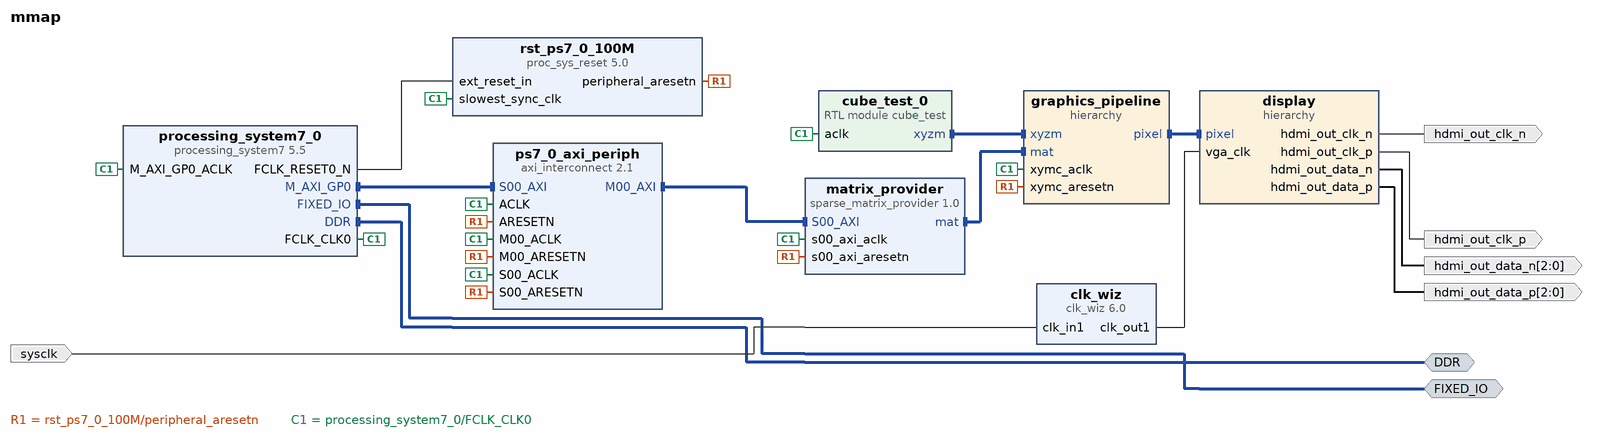
[diagram p0: block diagram of the top level]
# Vivado block design mmap, xc7z020clg400-1, Vivado 2018.3
create_bd_design mmap

create_bd_intf_port -mode Master -vlnv xilinx.com:interface:ddrx_rtl:1.0 DDR
create_bd_intf_port -mode Master -vlnv xilinx.com:display_processing_system7:fixedio_rtl:1.0 FIXED_IO
create_bd_port -dir I -type clk sysclk
set_property -dict {CONFIG.FREQ_HZ 125000000} [get_bd_ports sysclk]
create_bd_port -dir O hdmi_out_clk_n
create_bd_port -dir O hdmi_out_clk_p
create_bd_port -dir O -from 2 -to 0 hdmi_out_data_p
create_bd_port -dir O -from 2 -to 0 hdmi_out_data_n

create_bd_cell -type ip -vlnv xilinx.com:ip:processing_system7:5.5 processing_system7_0
set_property -dict [list \
  CONFIG.PCW_APU_PERIPHERAL_FREQMHZ 650 \
  CONFIG.PCW_CRYSTAL_PERIPHERAL_FREQMHZ 50 \
  CONFIG.PCW_ENET0_ENET0_IO {MIO 16 .. 27} \
  CONFIG.PCW_ENET0_GRP_MDIO_ENABLE 1 \
  CONFIG.PCW_ENET0_GRP_MDIO_IO {MIO 52 .. 53} \
  CONFIG.PCW_ENET0_PERIPHERAL_ENABLE 1 \
  CONFIG.PCW_ENET0_RESET_ENABLE 1 \
  CONFIG.PCW_ENET0_RESET_IO {MIO 9} \
  CONFIG.PCW_ENET_RESET_ENABLE 1 \
  CONFIG.PCW_ENET_RESET_SELECT {Share reset pin} \
  CONFIG.PCW_FPGA0_PERIPHERAL_FREQMHZ 100 \
  CONFIG.PCW_FPGA1_PERIPHERAL_FREQMHZ 50 \
  CONFIG.PCW_GPIO_MIO_GPIO_ENABLE 1 \
  CONFIG.PCW_GPIO_MIO_GPIO_IO MIO \
  CONFIG.PCW_I2C_RESET_ENABLE 1 \
  CONFIG.PCW_M_AXI_GP0_FREQMHZ 10 \
  CONFIG.PCW_PERIPHERAL_BOARD_PRESET part0 \
  CONFIG.PCW_PRESET_BANK1_VOLTAGE {LVCMOS 1.8V} \
  CONFIG.PCW_QSPI_GRP_FBCLK_ENABLE 1 \
  CONFIG.PCW_QSPI_GRP_FBCLK_IO {MIO 8} \
  CONFIG.PCW_QSPI_GRP_SINGLE_SS_ENABLE 1 \
  CONFIG.PCW_QSPI_GRP_SINGLE_SS_IO {MIO 1 .. 6} \
  CONFIG.PCW_QSPI_PERIPHERAL_ENABLE 1 \
  CONFIG.PCW_QSPI_QSPI_IO {MIO 1 .. 6} \
  CONFIG.PCW_SD0_GRP_CD_ENABLE 1 \
  CONFIG.PCW_SD0_GRP_CD_IO {MIO 47} \
  CONFIG.PCW_SD0_GRP_WP_ENABLE 0 \
  CONFIG.PCW_SD0_PERIPHERAL_ENABLE 1 \
  CONFIG.PCW_SD0_SD0_IO {MIO 40 .. 45} \
  CONFIG.PCW_SDIO_PERIPHERAL_FREQMHZ 50 \
  CONFIG.PCW_SINGLE_QSPI_DATA_MODE x4 \
  CONFIG.PCW_UART0_PERIPHERAL_ENABLE 1 \
  CONFIG.PCW_UART0_UART0_IO {MIO 14 .. 15} \
  CONFIG.PCW_UART1_PERIPHERAL_ENABLE 0 \
  CONFIG.PCW_UART_PERIPHERAL_FREQMHZ 100 \
  CONFIG.PCW_UIPARAM_DDR_BUS_WIDTH {16 Bit} \
  CONFIG.PCW_UIPARAM_DDR_FREQ_MHZ 525 \
  CONFIG.PCW_UIPARAM_DDR_PARTNO {MT41J256M16 RE-125} \
  CONFIG.PCW_USB0_PERIPHERAL_ENABLE 0 \
  CONFIG.PCW_USB_RESET_ENABLE 1 \
] [get_bd_cells processing_system7_0]
# 484 more settings of processing_system7_0 are not shown: defaults, MIO pin electricals, DDR timing, and values the tool derives
create_bd_cell -type ip -vlnv xilinx.com:ip:clk_wiz:6.0 clk_wiz
set_property -dict [list \
  CONFIG.CLKIN1_JITTER_PS 80.0 \
  CONFIG.CLKOUT1_DRIVES BUFG \
  CONFIG.CLKOUT1_JITTER 209.236 \
  CONFIG.CLKOUT1_PHASE_ERROR 234.038 \
  CONFIG.CLKOUT1_REQUESTED_OUT_FREQ 108 \
  CONFIG.CLKOUT2_DRIVES BUFG \
  CONFIG.CLKOUT3_DRIVES BUFG \
  CONFIG.CLKOUT4_DRIVES BUFG \
  CONFIG.CLKOUT5_DRIVES BUFG \
  CONFIG.CLKOUT6_DRIVES BUFG \
  CONFIG.CLKOUT7_DRIVES BUFG \
  CONFIG.FEEDBACK_SOURCE FDBK_AUTO \
  CONFIG.MMCM_CLKFBOUT_MULT_F 40.500 \
  CONFIG.MMCM_CLKIN1_PERIOD 8.000 \
  CONFIG.MMCM_CLKOUT0_DIVIDE_F 9.375 \
  CONFIG.MMCM_COMPENSATION ZHOLD \
  CONFIG.MMCM_DIVCLK_DIVIDE 5 \
  CONFIG.PRIMITIVE MMCM \
  CONFIG.PRIM_IN_FREQ 125 \
  CONFIG.USE_LOCKED false \
  CONFIG.USE_RESET false \
] [get_bd_cells clk_wiz]
create_bd_cell -type hier display
create_bd_cell -type ip -vlnv xilinx.com:ip:proc_sys_reset:5.0 rst_ps7_0_100M
create_bd_cell -type hier graphics_pipeline
create_bd_cell -type ip -vlnv xilinx.com:ip:axi_interconnect:2.1 ps7_0_axi_periph
set_property -dict {CONFIG.NUM_MI 1} [get_bd_cells ps7_0_axi_periph]
create_bd_cell -type ip -vlnv user.org:user:sparse_matrix_provider:1.0 matrix_provider
create_bd_cell -type module -reference cube_test cube_test_0

# ---- hierarchy /display ----
current_bd_instance /display
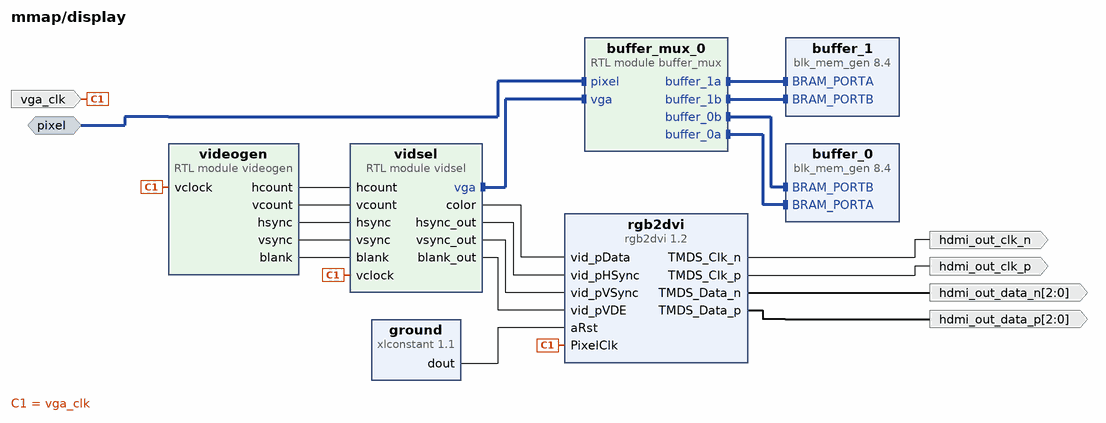
[diagram p1: block diagram inside /display]
create_bd_intf_pin -mode Slave -vlnv huntingt:user:pixel_rtl:1.0 pixel
create_bd_pin -dir I -type clk vga_clk
create_bd_pin -dir O -type clk hdmi_out_clk_p
create_bd_pin -dir O -type clk hdmi_out_clk_n
create_bd_pin -dir O -from 2 -to 0 hdmi_out_data_p
create_bd_pin -dir O -from 2 -to 0 hdmi_out_data_n

create_bd_cell -type ip -vlnv xilinx.com:ip:blk_mem_gen:8.4 buffer_0
set_property -dict [list \
  CONFIG.Enable_32bit_Address false \
  CONFIG.Enable_B Use_ENB_Pin \
  CONFIG.Fill_Remaining_Memory_Locations false \
  CONFIG.Load_Init_File false \
  CONFIG.Memory_Type Simple_Dual_Port_RAM \
  CONFIG.Operating_Mode_A NO_CHANGE \
  CONFIG.Port_B_Clock 100 \
  CONFIG.Port_B_Enable_Rate 100 \
  CONFIG.Read_Width_B 1 \
  CONFIG.Register_PortB_Output_of_Memory_Primitives true \
  CONFIG.Use_Byte_Write_Enable false \
  CONFIG.Write_Depth_A 1048576 \
  CONFIG.Write_Width_A 1 \
  CONFIG.Write_Width_B 1 \
  CONFIG.use_bram_block Stand_Alone \
] [get_bd_cells buffer_0]
create_bd_cell -type ip -vlnv digilentinc.com:ip:rgb2dvi:1.2 rgb2dvi
set_property -dict {CONFIG.kClkRange 2} [get_bd_cells rgb2dvi]
create_bd_cell -type ip -vlnv xilinx.com:ip:blk_mem_gen:8.4 buffer_1
set_property -dict [list \
  CONFIG.Enable_32bit_Address false \
  CONFIG.Enable_B Use_ENB_Pin \
  CONFIG.Memory_Type Simple_Dual_Port_RAM \
  CONFIG.Operating_Mode_A NO_CHANGE \
  CONFIG.Port_B_Clock 100 \
  CONFIG.Port_B_Enable_Rate 100 \
  CONFIG.Read_Width_B 1 \
  CONFIG.Register_PortB_Output_of_Memory_Primitives true \
  CONFIG.Use_Byte_Write_Enable false \
  CONFIG.Write_Depth_A 1048576 \
  CONFIG.Write_Width_A 1 \
  CONFIG.Write_Width_B 1 \
  CONFIG.use_bram_block Stand_Alone \
] [get_bd_cells buffer_1]
create_bd_cell -type ip -vlnv xilinx.com:ip:xlconstant:1.1 ground
set_property -dict {CONFIG.CONST_VAL 0} [get_bd_cells ground]
create_bd_cell -type module -reference buffer_mux buffer_mux_0
create_bd_cell -type module -reference videogen videogen
create_bd_cell -type module -reference vidsel vidsel

# ---- hierarchy /graphics_pipeline ----
current_bd_instance /graphics_pipeline
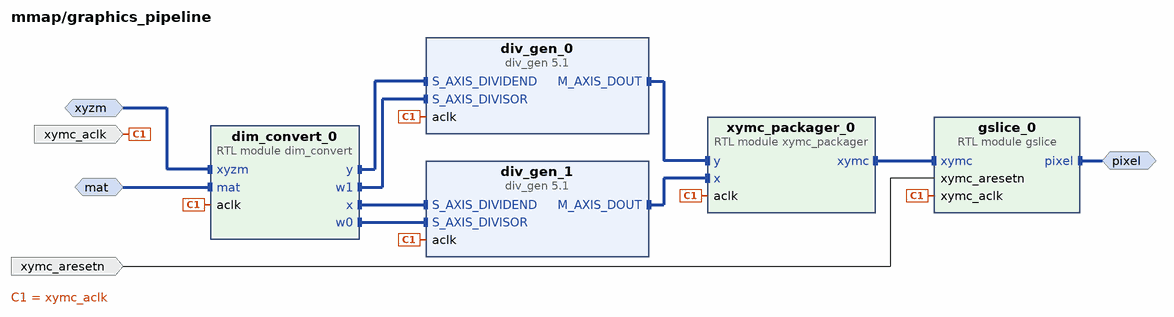
[diagram p2: block diagram inside /graphics_pipeline]
create_bd_intf_pin -mode Slave -vlnv xilinx.com:interface:axis_rtl:1.0 xyzm
create_bd_intf_pin -mode Slave -vlnv xilinx.com:interface:axis_rtl:1.0 mat
create_bd_intf_pin -mode Master -vlnv huntingt:user:pixel_rtl:1.0 pixel
create_bd_pin -dir I -type rst xymc_aresetn
create_bd_pin -dir I -type clk xymc_aclk

create_bd_cell -type ip -vlnv xilinx.com:ip:div_gen:5.1 div_gen_0
set_property -dict [list \
  CONFIG.FlowControl Blocking \
  CONFIG.OptimizeGoal Resources \
  CONFIG.OutTLASTBehv Pass_Dividend_TLAST \
  CONFIG.OutTready true \
  CONFIG.dividend_and_quotient_width 32 \
  CONFIG.dividend_has_tlast true \
  CONFIG.fractional_width 16 \
  CONFIG.latency 39 \
] [get_bd_cells div_gen_0]
create_bd_cell -type ip -vlnv xilinx.com:ip:div_gen:5.1 div_gen_1
set_property -dict [list \
  CONFIG.FlowControl Blocking \
  CONFIG.OptimizeGoal Resources \
  CONFIG.OutTLASTBehv Pass_Dividend_TLAST \
  CONFIG.OutTready true \
  CONFIG.dividend_and_quotient_width 32 \
  CONFIG.dividend_has_tlast true \
  CONFIG.fractional_width 16 \
  CONFIG.latency 39 \
] [get_bd_cells div_gen_1]
create_bd_cell -type module -reference gslice gslice_0
create_bd_cell -type module -reference dim_convert dim_convert_0
create_bd_cell -type module -reference xymc_packager xymc_packager_0

# ---- connections ----

current_bd_instance /display
connect_bd_intf_net [get_bd_intf_pins buffer_mux_0/buffer_0b] [get_bd_intf_pins buffer_0/BRAM_PORTB]
connect_bd_intf_net [get_bd_intf_pins buffer_mux_0/buffer_1a] [get_bd_intf_pins buffer_1/BRAM_PORTA]
connect_bd_intf_net [get_bd_intf_pins buffer_mux_0/buffer_0a] [get_bd_intf_pins buffer_0/BRAM_PORTA]
connect_bd_intf_net [get_bd_intf_pins vidsel/vga] [get_bd_intf_pins buffer_mux_0/vga]
connect_bd_intf_net [get_bd_intf_pins buffer_mux_0/buffer_1b] [get_bd_intf_pins buffer_1/BRAM_PORTB]
connect_bd_intf_net [get_bd_intf_pins pixel] [get_bd_intf_pins buffer_mux_0/pixel]
connect_bd_net -net videogen_0_hcount [get_bd_pins videogen/hcount] [get_bd_pins vidsel/hcount]
connect_bd_net -net videogen_0_vcount [get_bd_pins videogen/vcount] [get_bd_pins vidsel/vcount]
connect_bd_net -net videogen_0_hsync [get_bd_pins videogen/hsync] [get_bd_pins vidsel/hsync]
connect_bd_net -net videogen_0_vsync [get_bd_pins videogen/vsync] [get_bd_pins vidsel/vsync]
connect_bd_net -net videogen_0_blank [get_bd_pins videogen/blank] [get_bd_pins vidsel/blank]
connect_bd_net -net vidsel_0_color [get_bd_pins vidsel/color] [get_bd_pins rgb2dvi/vid_pData]
connect_bd_net -net vidsel_0_hsync_out [get_bd_pins vidsel/hsync_out] [get_bd_pins rgb2dvi/vid_pHSync]
connect_bd_net -net vidsel_0_vsync_out [get_bd_pins vidsel/vsync_out] [get_bd_pins rgb2dvi/vid_pVSync]
connect_bd_net -net vidsel_0_blank_out [get_bd_pins vidsel/blank_out] [get_bd_pins rgb2dvi/vid_pVDE]
connect_bd_net -net rgb2dvi_0_TMDS_Clk_p [get_bd_pins rgb2dvi/TMDS_Clk_p] [get_bd_pins hdmi_out_clk_p]
connect_bd_net -net rgb2dvi_0_TMDS_Clk_n [get_bd_pins rgb2dvi/TMDS_Clk_n] [get_bd_pins hdmi_out_clk_n]
connect_bd_net -net rgb2dvi_0_TMDS_Data_p [get_bd_pins rgb2dvi/TMDS_Data_p] [get_bd_pins hdmi_out_data_p]
connect_bd_net -net rgb2dvi_0_TMDS_Data_n [get_bd_pins rgb2dvi/TMDS_Data_n] [get_bd_pins hdmi_out_data_n]
connect_bd_net [get_bd_pins ground/dout] [get_bd_pins rgb2dvi/aRst]
connect_bd_net [get_bd_pins vga_clk] [get_bd_pins rgb2dvi/PixelClk] [get_bd_pins videogen/vclock] [get_bd_pins vidsel/vclock]

current_bd_instance /graphics_pipeline
connect_bd_intf_net [get_bd_intf_pins dim_convert_0/x] [get_bd_intf_pins div_gen_1/S_AXIS_DIVIDEND]
connect_bd_intf_net [get_bd_intf_pins dim_convert_0/y] [get_bd_intf_pins div_gen_0/S_AXIS_DIVIDEND]
connect_bd_intf_net [get_bd_intf_pins div_gen_1/M_AXIS_DOUT] [get_bd_intf_pins xymc_packager_0/x]
connect_bd_intf_net -intf_net cube_test_0_xyzm [get_bd_intf_pins xyzm] [get_bd_intf_pins dim_convert_0/xyzm]
connect_bd_intf_net [get_bd_intf_pins div_gen_0/M_AXIS_DOUT] [get_bd_intf_pins xymc_packager_0/y]
connect_bd_intf_net [get_bd_intf_pins dim_convert_0/w0] [get_bd_intf_pins div_gen_1/S_AXIS_DIVISOR]
connect_bd_intf_net [get_bd_intf_pins dim_convert_0/w1] [get_bd_intf_pins div_gen_0/S_AXIS_DIVISOR]
connect_bd_intf_net [get_bd_intf_pins mat] [get_bd_intf_pins dim_convert_0/mat]
connect_bd_intf_net [get_bd_intf_pins pixel] [get_bd_intf_pins gslice_0/pixel]
connect_bd_intf_net [get_bd_intf_pins xymc_packager_0/xymc] [get_bd_intf_pins gslice_0/xymc]
connect_bd_net -net processing_system7_0_FCLK_CLK0 [get_bd_pins xymc_aclk] \
  [get_bd_pins div_gen_0/aclk] [get_bd_pins div_gen_1/aclk] [get_bd_pins gslice_0/xymc_aclk] [get_bd_pins dim_convert_0/aclk] \
  [get_bd_pins xymc_packager_0/aclk]
connect_bd_net [get_bd_pins xymc_aresetn] [get_bd_pins gslice_0/xymc_aresetn]

current_bd_instance /
connect_bd_intf_net [get_bd_intf_pins cube_test_0/xyzm] [get_bd_intf_pins graphics_pipeline/xyzm]
connect_bd_intf_net [get_bd_intf_ports FIXED_IO] [get_bd_intf_pins processing_system7_0/FIXED_IO]
connect_bd_intf_net [get_bd_intf_ports DDR] [get_bd_intf_pins processing_system7_0/DDR]
connect_bd_intf_net [get_bd_intf_pins processing_system7_0/M_AXI_GP0] [get_bd_intf_pins ps7_0_axi_periph/S00_AXI]
connect_bd_intf_net -intf_net sparse_matrix_provid_0_mat [get_bd_intf_pins matrix_provider/mat] [get_bd_intf_pins graphics_pipeline/mat]
connect_bd_intf_net [get_bd_intf_pins ps7_0_axi_periph/M00_AXI] [get_bd_intf_pins matrix_provider/S00_AXI]
connect_bd_intf_net [get_bd_intf_pins graphics_pipeline/pixel] [get_bd_intf_pins display/pixel]
connect_bd_net -net rgb2dvi_0_TMDS_Clk_p [get_bd_pins display/hdmi_out_clk_p] [get_bd_ports hdmi_out_clk_p]
connect_bd_net -net rgb2dvi_0_TMDS_Clk_n [get_bd_pins display/hdmi_out_clk_n] [get_bd_ports hdmi_out_clk_n]
connect_bd_net -net rgb2dvi_0_TMDS_Data_p [get_bd_pins display/hdmi_out_data_p] [get_bd_ports hdmi_out_data_p]
connect_bd_net -net rgb2dvi_0_TMDS_Data_n [get_bd_pins display/hdmi_out_data_n] [get_bd_ports hdmi_out_data_n]
connect_bd_net [get_bd_pins processing_system7_0/FCLK_RESET0_N] [get_bd_pins rst_ps7_0_100M/ext_reset_in]
connect_bd_net [get_bd_pins rst_ps7_0_100M/peripheral_aresetn] \
  [get_bd_pins graphics_pipeline/xymc_aresetn] [get_bd_pins ps7_0_axi_periph/S00_ARESETN] \
  [get_bd_pins ps7_0_axi_periph/M00_ARESETN] [get_bd_pins ps7_0_axi_periph/ARESETN] \
  [get_bd_pins matrix_provider/s00_axi_aresetn]
connect_bd_net [get_bd_ports sysclk] [get_bd_pins clk_wiz/clk_in1]
connect_bd_net [get_bd_pins clk_wiz/clk_out1] [get_bd_pins display/vga_clk]
connect_bd_net [get_bd_pins processing_system7_0/FCLK_CLK0] \
  [get_bd_pins rst_ps7_0_100M/slowest_sync_clk] [get_bd_pins graphics_pipeline/xymc_aclk] \
  [get_bd_pins processing_system7_0/M_AXI_GP0_ACLK] [get_bd_pins ps7_0_axi_periph/S00_ACLK] \
  [get_bd_pins ps7_0_axi_periph/M00_ACLK] [get_bd_pins ps7_0_axi_periph/ACLK] [get_bd_pins matrix_provider/s00_axi_aclk] \
  [get_bd_pins cube_test_0/aclk]

# ---- address map ----
assign_bd_address -offset 0x43C00000 -range 64K -target_address_space [get_bd_addr_spaces processing_system7_0/Data] [get_bd_addr_segs matrix_provider/S00_AXI/S00_AXI_reg]

validate_bd_design
save_bd_design
